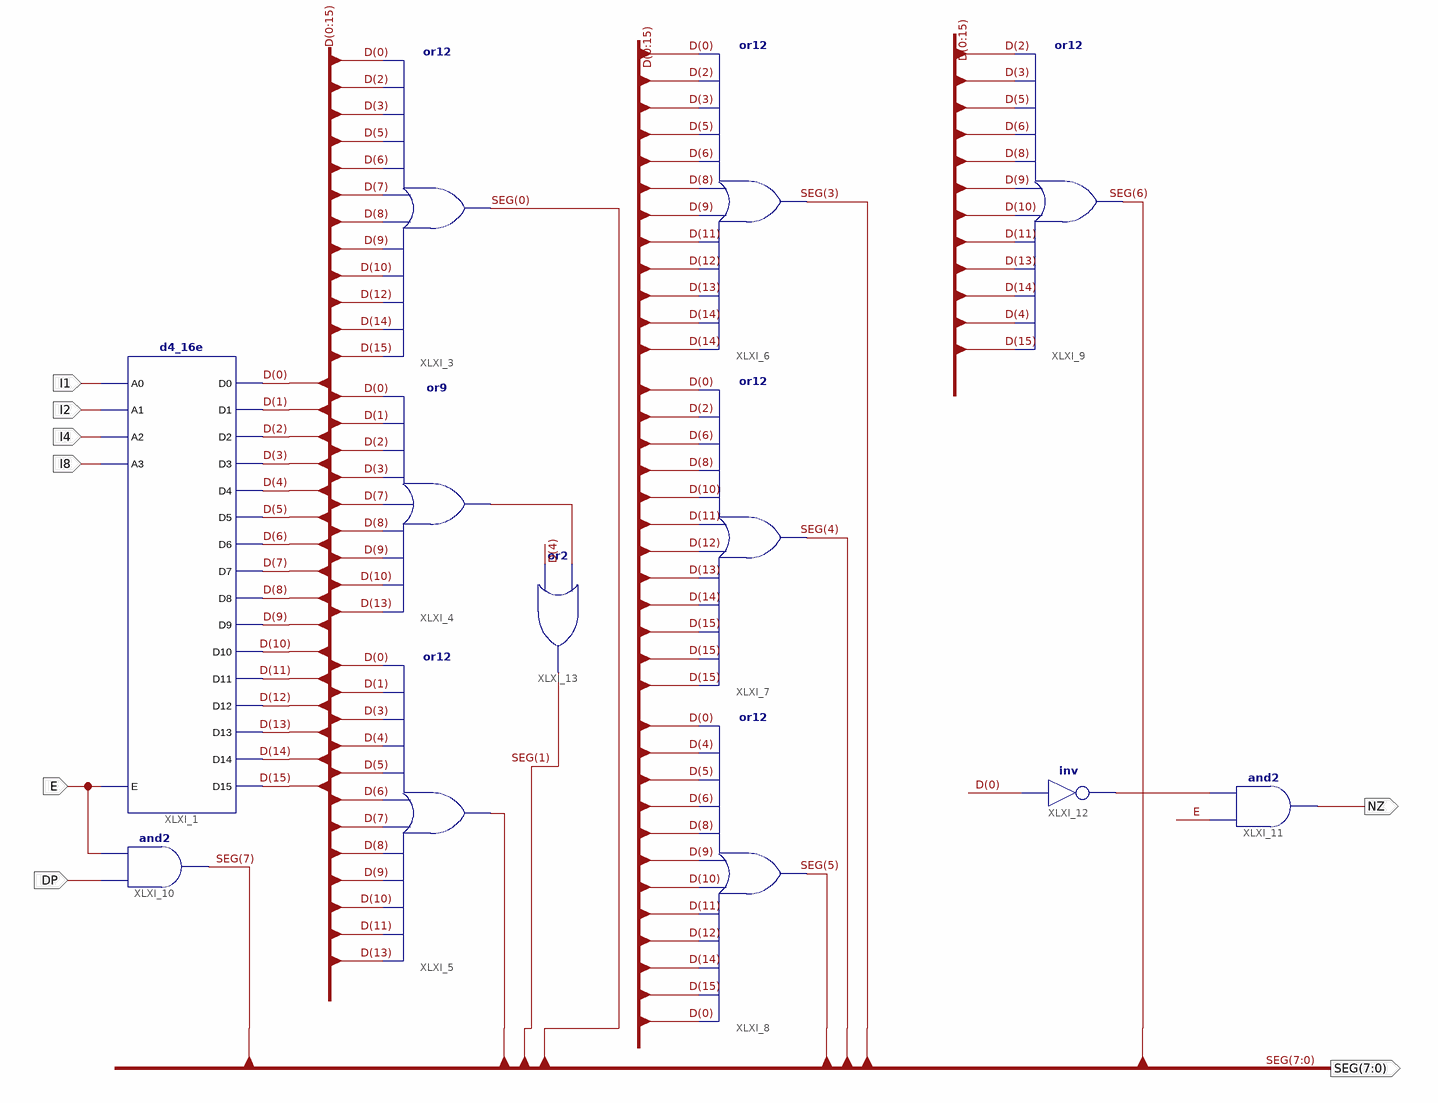
[diagram p0: schematic sheet 1]
// Xilinx ISE schematic bin2seg.sch (spartan3e) as structural Verilog: 12 symbols, 8 ports
module bin2seg (
  input  I1,
  input  I2,
  input  I4,
  input  I8,
  input  E,
  input  DP,
  output [7:0] SEG,
  output NZ
);

  wire XLXN_155, XLXN_156;
  wire [15:0] D;

  d4_16e XLXI_1 (
    .A0(I1), .A1(I2), .A2(I4), .A3(I8), .E(E), .D0(D[0]), .D1(D[1]), .D10(D[10]), .D11(D[11]), .D12(D[12]),
    .D13(D[13]), .D14(D[14]), .D15(D[15]), .D2(D[2]), .D3(D[3]), .D4(D[4]), .D5(D[5]), .D6(D[6]), .D7(D[7]),
    .D8(D[8]), .D9(D[9]));
  or XLXI_3 (SEG[0], D[15], D[14], D[12], D[10], D[9], D[8], D[7], D[6], D[5], D[3], D[2], D[0]);
  or XLXI_4 (XLXN_156, D[13], D[10], D[9], D[8], D[7], D[3], D[2], D[1], D[0]);
  or XLXI_5 (SEG[2], D[13], D[11], D[10], D[9], D[8], D[7], D[6], D[5], D[4], D[3], D[1], D[0]);
  or XLXI_6 (SEG[3], D[14], D[14], D[13], D[12], D[11], D[9], D[8], D[6], D[5], D[3], D[2], D[0]);
  or XLXI_7 (SEG[4], D[15], D[15], D[15], D[14], D[13], D[12], D[11], D[10], D[8], D[6], D[2], D[0]);
  or XLXI_8 (SEG[5], D[0], D[15], D[14], D[12], D[11], D[10], D[9], D[8], D[6], D[5], D[4], D[0]);
  or XLXI_9 (SEG[6], D[15], D[4], D[14], D[13], D[11], D[10], D[9], D[8], D[6], D[5], D[3], D[2]);
  and XLXI_10 (SEG[7], DP, E);
  and XLXI_11 (NZ, E, XLXN_155);
  not XLXI_12 (XLXN_155, D[0]);
  or XLXI_13 (SEG[1], D[4], XLXN_156);
endmodule
